# EAGLE design blinds-shield (EAGLE 9.3.2)

## Sheet 1 of 2

## Sheet 2 of 2
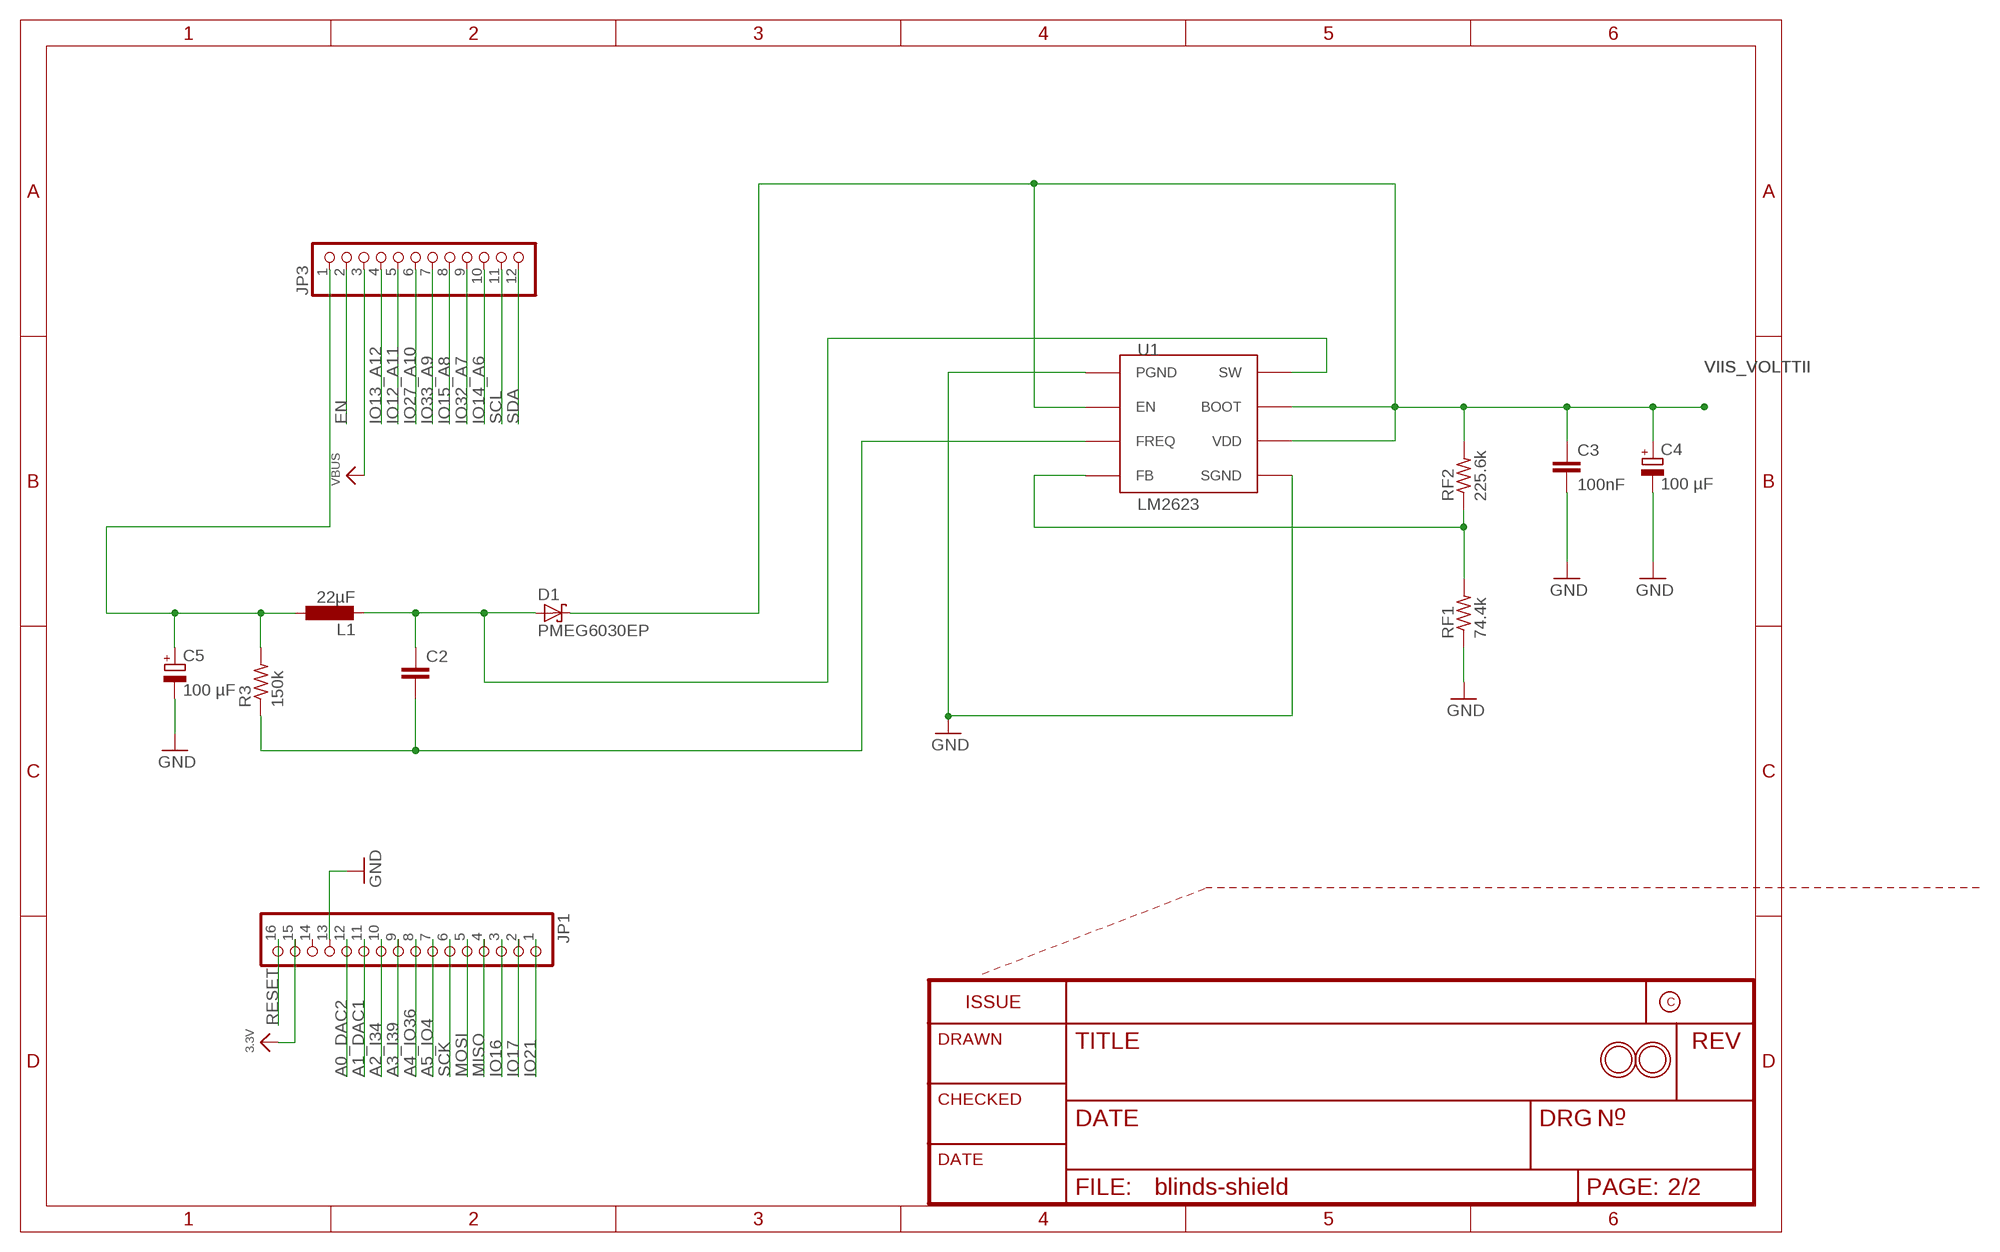
[diagram p0: schematic, sheet 2]

### Parts
C2  C-EU025-060X050  [C025-060X050]
C3  100nF  C-EU025-060X050  [C025-060X050]
C4  100 µF  CPOL-EU085CS-1AR  [085CS_1AR]
C5  100 µF  CPOL-EU085CS-1AR  [085CS_1AR]
D1  PMEG6030EP  [SOD128]
JP1  HEADER-1X16_MIN  [1X16_ROUND_MIN]
JP3  HEADER-1X12_MIN  [1X12_ROUND_MIN]
L1  22µF  L-EUL5650M  [L5650M]
R3  150k  R-US_R5025  [R5025]
RF1  74.4k  R-US_R5025  [R5025]
RF2  225.6k  R-US_R5025  [R5025]
U1  LM2623  [VSSOP8]
U$31  MOUNTINGHOLE2.5  [MOUNTINGHOLE_2.5_PLATED]
U$32  MOUNTINGHOLE2.5  [MOUNTINGHOLE_2.5_PLATED]

### Nets
3.3V: JP1.15
A0_DAC2: JP1.12
A1_DAC1: JP1.11
A2_I34: JP1.10
A3_I39: JP1.9
A4_IO36: JP1.8
A5_IO4: JP1.7
EN: JP3.2
GND: C3.2 C4.- C5.- JP1.13 RF1.1 U1.PGND U1.SGND
IO12_A11: JP3.5
IO13_A12: JP3.4
IO14_A6: JP3.10
IO15_A8: JP3.8
IO16: JP1.3
IO17: JP1.2
IO21: JP1.1
IO27_A10: JP3.6
IO32_A7: JP3.9
IO33_A9: JP3.7
MISO: JP1.4
MOSI: JP1.5
N$1: C5.+ JP3.1 L1.1 R3.2
N$2: C2.1 D1.2(A) L1.2 U1.SW
N$3: C2.2 R3.1 U1.FREQ
N$5: RF1.2 RF2.1 U1.FB
RESET: JP1.16
SCK: JP1.6
SCL: JP3.11
SDA: JP3.12
VBUS: JP3.3
VIIS_VOLTTII: C3.1 C4.+ D1.1(K) RF2.2 U1.BOOT U1.EN U1.VDD
Unconnected: JP1.14

## Library data of the parts
C2 C3 = rcl:C-EU: CAPACITOR, European symbol; SPICEPREFIX: C
C4 C5 = rcl:CPOL-EU: POLARIZED CAPACITOR, European symbol; SPICEPREFIX: C
D1 = nxp_60_1_1:PMEG6030: 60V 3A low VF dual MEGA Schottky barrier rectifier Planar Maximum Efficiency General Application (MEGA) Schottky barrier rectifier in common cathode configuration with an integrated guard ring for stress protection, encapsulated in a SOT1061 leadless small Surface-Mounted Device (SMD) plastic package with medium power capability. AAL Eindhoven MK
JP1 = microbuilder:HEADER-1X16: PIN HEADER
JP3 = microbuilder:HEADER-1X12
L1 = rcl:L-EU: INDUCTOR, European symbol; SPICEPREFIX: L
R3 RF1 RF2 = rcl:R-US_: RESISTOR, American symbol; SPICEPREFIX: R
U1 = texas:LM2623
U$31 U$32 = microbuilder:MOUNTINGHOLE: Mounting Hole For #2 screws (0.086"/2.18mm width, 0.094"/2.4mm hole) use 2.5mm; BOM: EXCLUDE

## Board
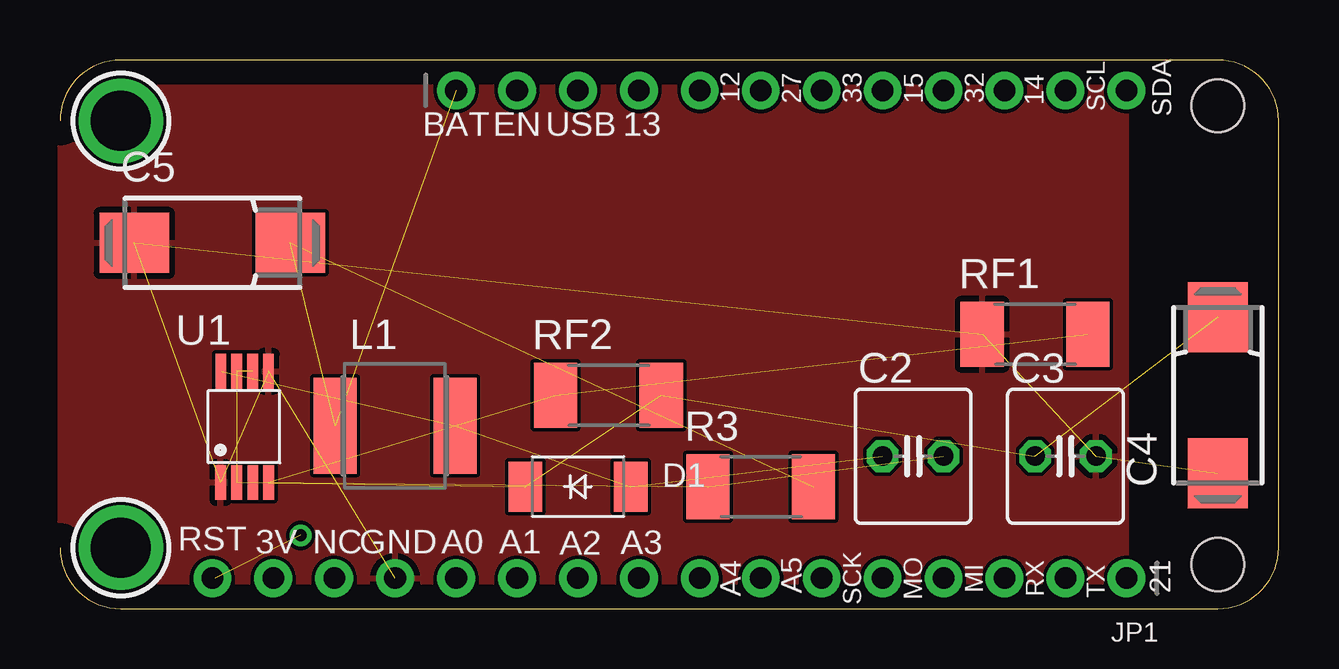
[diagram p1: board, top side]
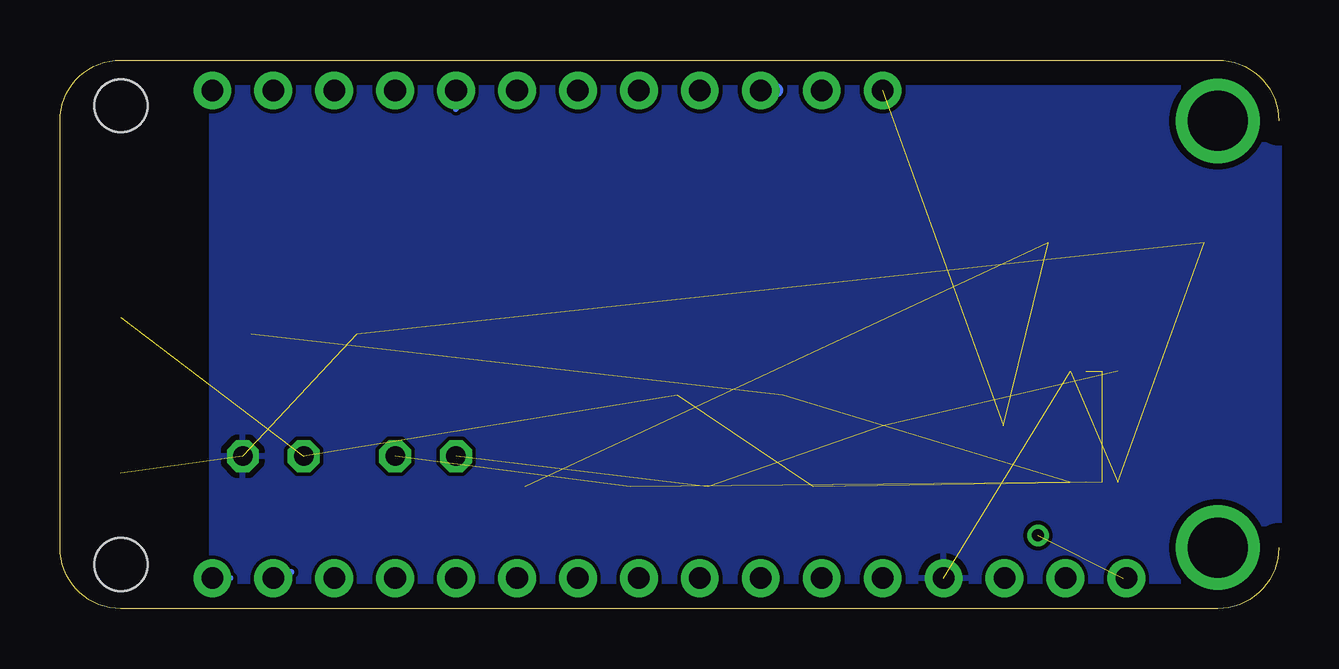
[diagram p2: board, bottom side, seen from below]

Size 50.8 x 22.86 mm. Coordinates in mm from the lower left corner, seen from the top.
Outline: 0,20.32 arc-90 2.54,22.86 48.26,22.86 arc-90 50.8,20.32 50.8,2.54 arc-90 48.26,0 2.54,0 arc-90 0,2.54
Copper layers (1*16): Top 0.035mm / dielectric 1.5mm / Bottom 0.035mm
Design rules "default": minimum track width 6mil, minimum drill 0.35mm, track to track 6mil, track to pad 6mil, pad to pad 6mil, via to via 6mil, smd to smd 6mil, copper to edge 40mil, drill to drill 6mil, minimum pad ring 10mil, minimum via ring 8mil, stop-mask expansion 4mil, vias tented up to drill 0mil, thermal gap 10mil
Holes 2.2 mm at 48.26,1.84 48.26,20.96

### Footprints (pad centres in the part's own frame; a part is rotated, then mirrored left to right if it is on the bottom)
C025-060X050 = drill 0.813 octagon: 1 -1.27,0; 2 1.27,0
085CS_1AR = smd 2.9 x 2.5: + 3.25,0; - -3.25,0
SOD128 = smd 1.4 x 2.1: 1 -2.2,0; 2 2.2,0
1X16_ROUND_MIN = drill 0.9 pad 1.575: 1 -19.05,0; 2 -16.51,0; 3 -13.97,0; 4 -11.43,0; 5 -8.89,0; 6 -6.35,0; 7 -3.81,0; 8 -1.27,0; 9 1.27,0; 10 3.81,0; 11 6.35,0; 12 8.89,0; 13 11.43,0; 14 13.97,0; 15 16.51,0; 16 19.05,0
1X12_ROUND_MIN = drill 0.9 pad 1.575: 1 -13.97,0; 2 -11.43,0; 3 -8.89,0; 4 -6.35,0; 5 -3.81,0; 6 -1.27,0; 7 1.27,0; 8 3.81,0; 9 6.35,0; 10 8.89,0; 11 11.43,0; 12 13.97,0
L5650M = smd 1.8 x 4: 1 -2.5,0; 2 2.5,0
R5025 = smd 1.8 x 2.7: 1 -2.2,0; 2 2.2,0
VSSOP8 = smd 0.45 x 1.45: BOOT -0.25,2.27; EN -0.25,-2.36; FB 1.08,-2.36; FREQ 0.42,-2.36; PGND -0.92,-2.36; SGND 1.07,2.27; SW -0.91,2.27; VDD 0.41,2.27
MOUNTINGHOLE_2.5_PLATED = drill 2.5 pad 3.2: P$1 0,0

### Placement (x,y rotation side)
C2  35.56,6.35 0 top
C3  41.91,6.35 0 top
C4  48.26,8.89 90 top
C5  6.35,15.24 0 top
D1  21.59,5.08 0 top
JP1  25.4,1.27 180 top
JP3  30.48,21.59 0 top
L1  13.97,7.62 0 top
R3  29.21,5.08 0 top
RF1  40.64,11.43 0 top
RF2  22.86,8.89 0 top
U1  7.62,7.62 0 top
U$31  2.54,20.32 270 top
U$32  2.54,2.54 270 top

### Tracks (layer width: path | path; a pad name or v marks a point on that pad's centre or on a via)
GND  (6 unrouted)
  pour Top: 0,22.86 0,0 44.45,0 44.45,22.86
  pour Bottom: 0,0 44.45,0 44.45,22.86 0,22.86
IO12_A11
  Top 0.254: 26.84,21.42 JP3.5
IO13_A12
  Bottom 0.254: 24.13,21.46 JP3.4
IO14_A6
  Bottom 0.254: 39.37,21.44 JP3.10
IO15_A8
  Bottom 0.254: 34.29,20.83 JP3.8
IO16
  Bottom 0.254: 38.73,1.27 JP1.3
IO17
  Bottom 0.254: 41.15,1.52 41.66,1.52 JP1.2
IO21
  Bottom 0.254: 43.69,1.27 JP1.1
IO27_A10
  Top 0.254: 29.38,21.42 JP3.6
IO33_A9
  Top 0.254: 32,21.59 JP3.7
N$1  (3 unrouted)
N$2  (3 unrouted)
N$3  (2 unrouted)
N$5  (2 unrouted)
RESET  (via drill 0.5)  (1 unrouted)
  Top 0.254: JP1.16 6.48,1.27
  other vias: 10.03,3.05
SCL
  Bottom 0.254: 42.29,21.21 JP3.11
SDA
  Bottom 0.254: 44.32,21.72 JP3.12
VBUS
  Bottom 0.61: 20.95,21.59 JP3.3
VIIS_VOLTTII  (6 unrouted)

### Text on the board
tPlace: 12 | 27 | 33 | 15 | 32 | 14 | SCL | SDA | BAT | EN | USB | 13 | RST | 3V | NC | GND | A0 | A1 | A2 | A3 | A4 | A5 | SCK | MO | MI | RX | TX | 21